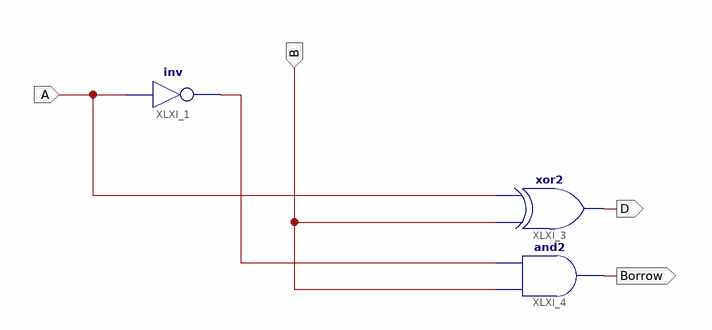
[diagram p0: schematic sheet 1]
// Xilinx ISE schematic half_subtractor.sch (artix7) as structural Verilog: 3 symbols, 4 ports
module half_subtractor (
  input  A,
  input  B,
  output D,
  output Borrow
);

  wire XLXN_1;

  not XLXI_1 (XLXN_1, A);
  xor XLXI_3 (D, B, A);
  and XLXI_4 (Borrow, B, XLXN_1);
endmodule
